# EAGLE design eCog107_Remote_Control (EAGLE 6.6.0)

## Sheet 1 of 2
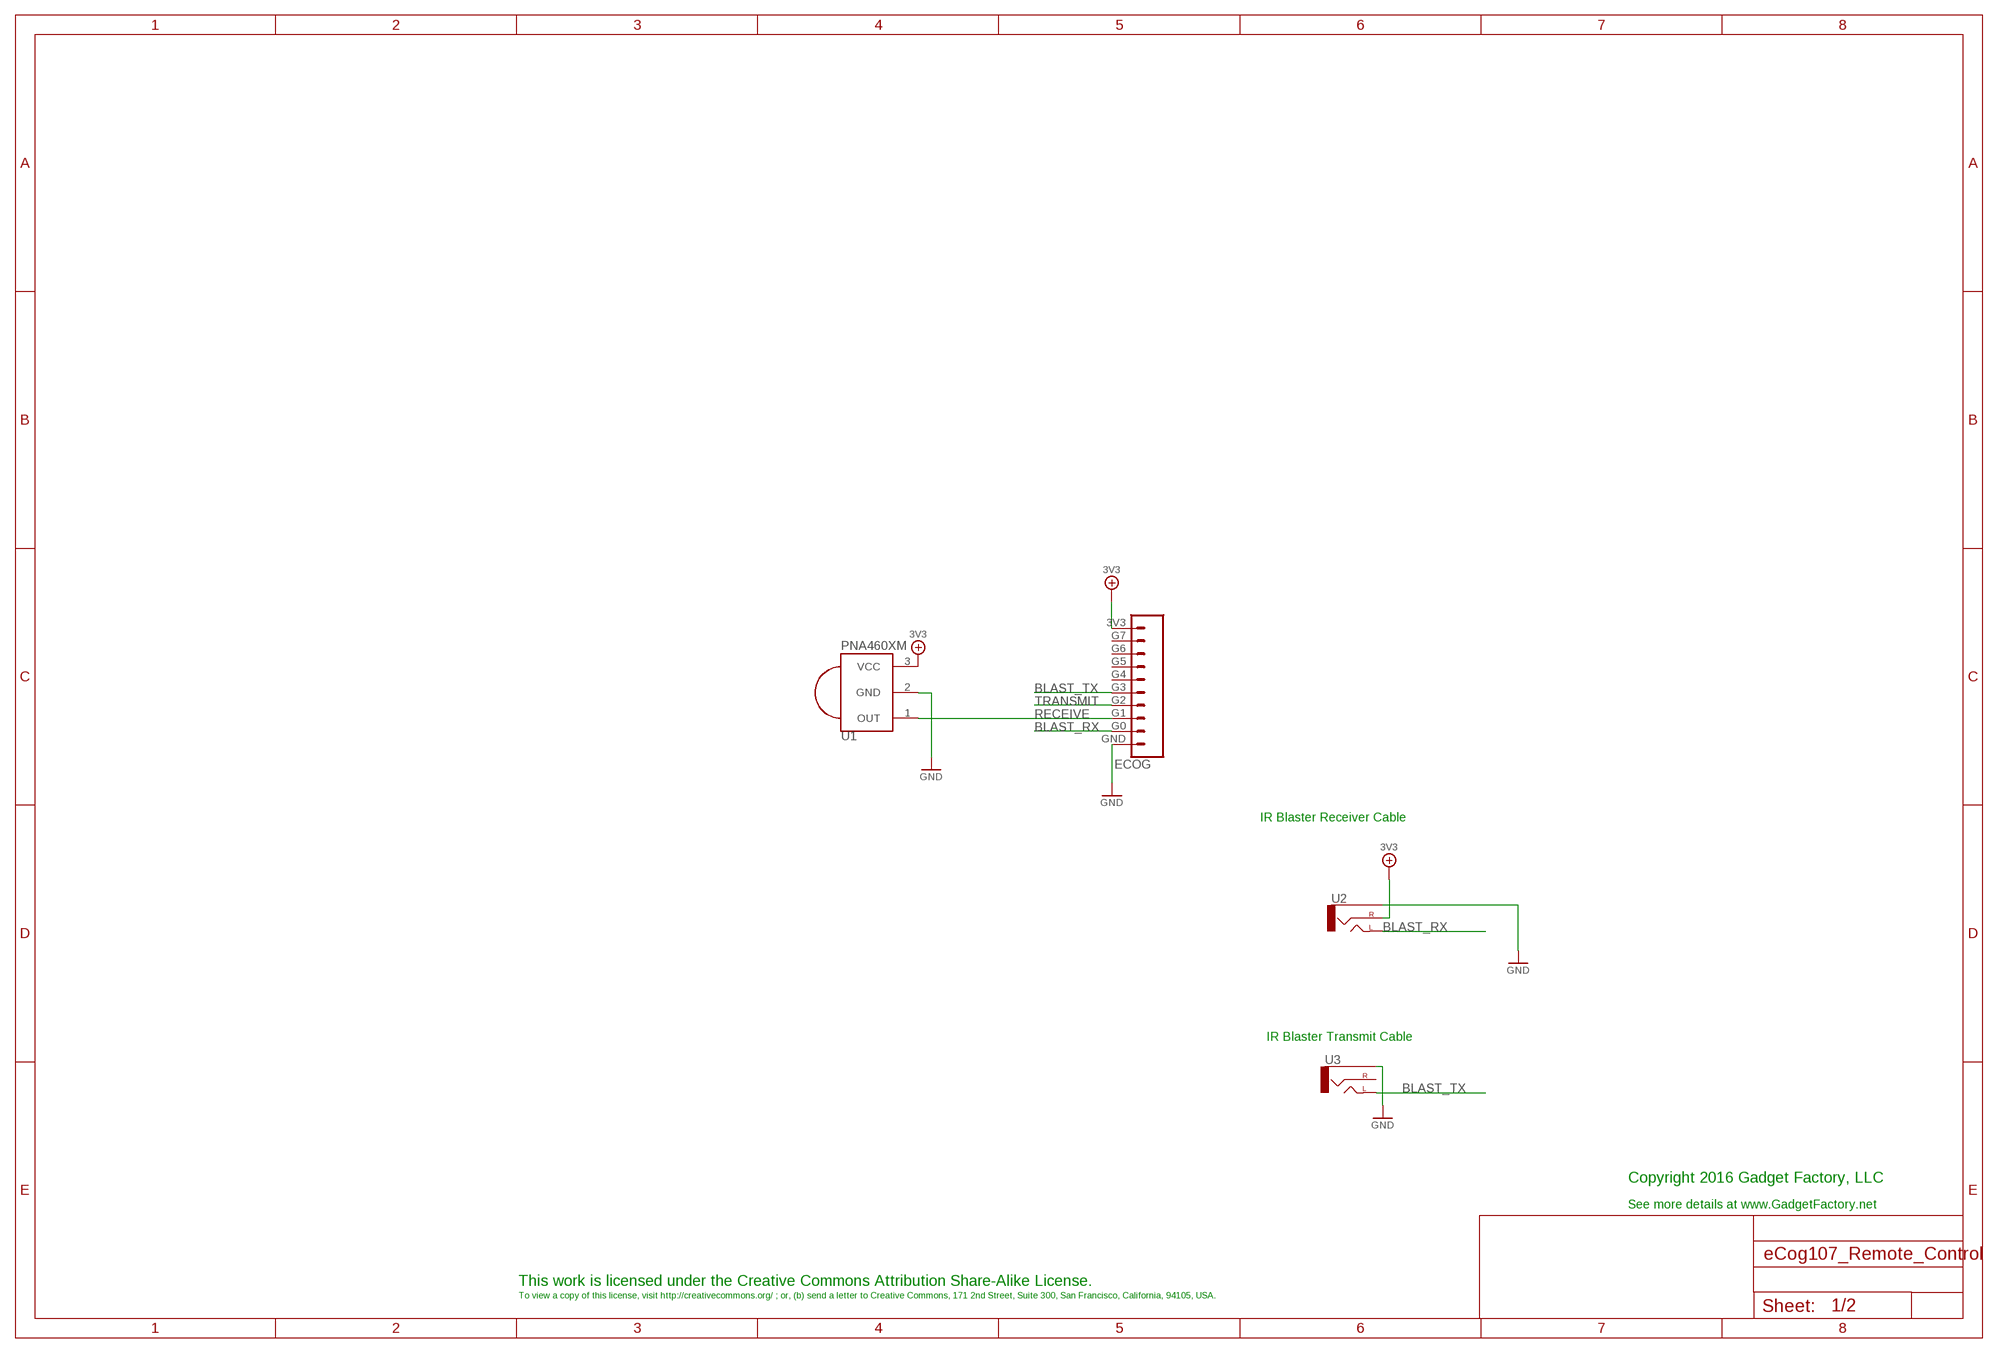
[diagram p0: schematic, sheet 1]

### Parts
ECOG  ECOG_GENERAL_ROWECOG_GENERAL_SMD  [ECOG_GENERAL_SMD]
U1  PNA460XM  [PNA460XM]
U2  AUDIO-JACKSMD2  [AUDIO-JACK-3.5MM-SMD]
U3  AUDIO-JACKSMD2  [AUDIO-JACK-3.5MM-SMD]

### Nets
3V3: ECOG.3V3 U1.3(VCC) U2.RING(RIGHT) ; also sheet 2
BLAST_RX: ECOG.G0 U2.TIP(LEFT)
BLAST_TX: ECOG.G3 U3.TIP(LEFT)
GND: ECOG.GND U1.2(GND) U2.SLEEVE U3.SLEEVE ; also sheet 2
RECEIVE: ECOG.G1 U1.1(OUT)
TRANSMIT: ECOG.G2 ; also sheet 2
Unconnected: ECOG.G4 ECOG.G5 ECOG.G6 ECOG.G7 U3.RING(RIGHT)

### Notes on the sheet
- IR Blaster Receiver Cable
- IR Blaster Transmit Cable
- Copyright 2016 Gadget Factory, LLC
- See more details at www.GadgetFactory.net
- This work is licensed under the Creative Commons Attribution Share-Alike License.
- To view a copy of this license, visit http://creativecommons.org/ ; or, (b) send a letter to Creative Commons, 171 2nd Street, Suite 300, San Francisco, California, 94105, USA.

## Sheet 2 of 2
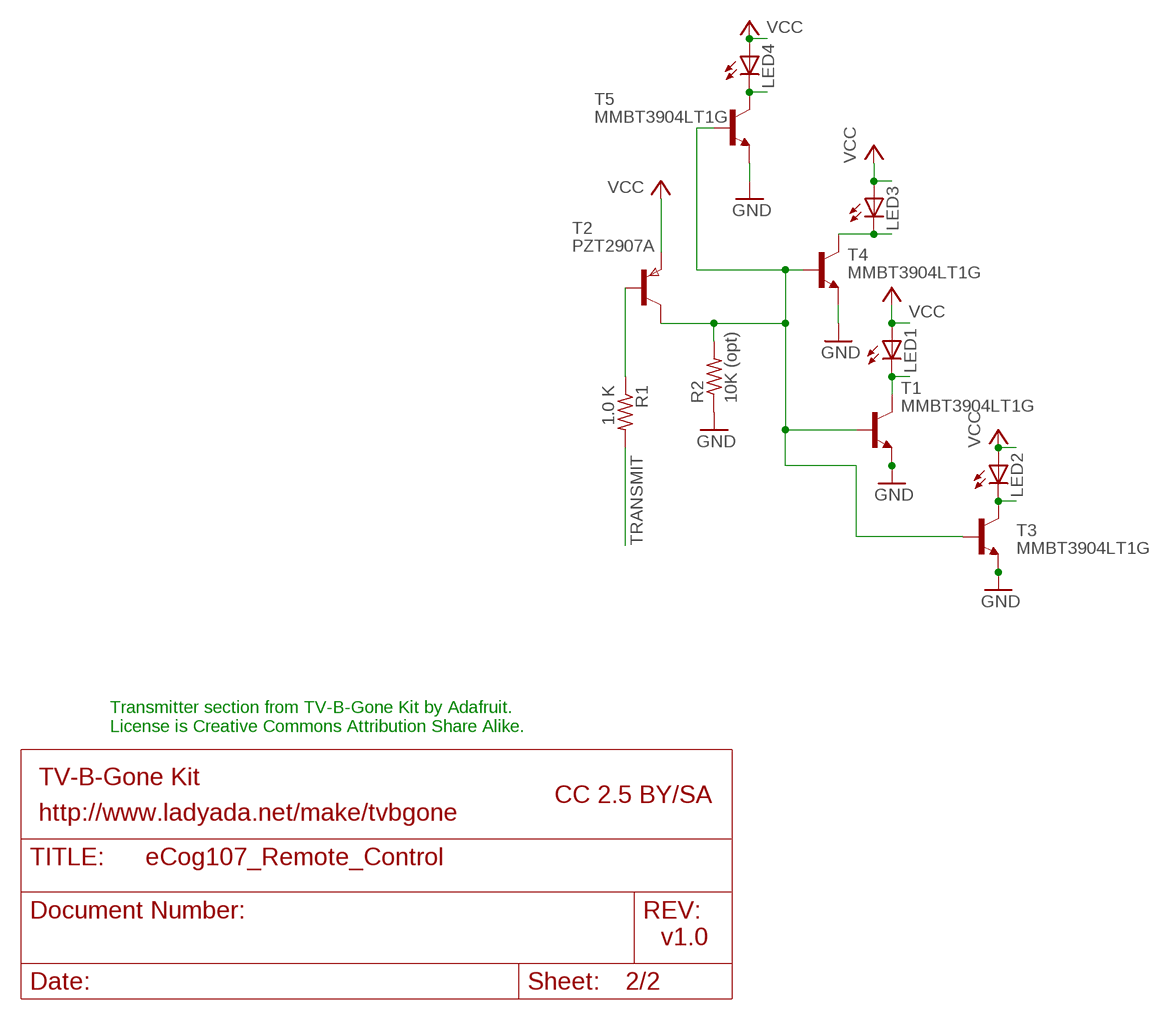
[diagram p1: schematic, sheet 2]

### Parts
LED1  LED5MM  [LED5MM]
LED2  LED5MM  [LED5MM]
LED3  LED5MM  [LED5MM]
LED4  LED5MM  [LED5MM]
R1  1.0 K  R-US_R0805  [R0805]
R2  10K (opt)  R-US_R0805  [R0805]
T1  MMBT3904LT1G  MMBT3904LT1-NPN-SOT23-BEC  [SOT23-BEC]
T2  PZT2907A  PNPSOT223  [SOT223]
T3  MMBT3904LT1G  MMBT3904LT1-NPN-SOT23-BEC  [SOT23-BEC]
T4  MMBT3904LT1G  MMBT3904LT1-NPN-SOT23-BEC  [SOT23-BEC]
T5  MMBT3904LT1G  MMBT3904LT1-NPN-SOT23-BEC  [SOT23-BEC]

### Nets
3V3: LED1.A LED2.A LED3.A LED4.A T2.3(E) ; supply symbol labelled VCC ; also sheet 1
GND: R2.1 T1.E T3.E T4.E T5.E ; also sheet 1
N$6: R1.1 T2.1(B)
N$7: LED1.K(C) T1.C
N$8: LED3.K(C) T4.C
N$9: LED2.K(C) T3.C
N$10: R2.2 T1.B T2.2(C) T2.4(C) T3.B T4.B T5.B
N$11: LED4.K(C) T5.C
TRANSMIT: R1.2 ; also sheet 1

### Notes on the sheet
- Transmitter section from TV-B-Gone Kit by Adafruit. 
  License is Creative Commons Attribution Share Alike.
- TV-B-Gone Kit
- CC 2.5 BY/SA
- http://www.ladyada.net/make/tvbgone
- v1.0

## Library data of the parts
ECOG = eCogs:ECOG_GENERAL_ROW; DIGIKEY: S1013EC-10-ND
LED1 LED4 = adafruit:LED: LED OSRAM: - CHIPLED LG R971, LG N971, LY N971, LG Q971, LY Q971, LO R971, LY R971 LH N974, LH R974 LS Q976, LO Q976, LY Q976 LO Q996 - Hyper CHIPLED LW Q18S LB Q993, LB Q99A, LB R99A - SideLED LS A670, LO A670, LY A670, LG A670, LP A670 LB A673, LV A673, LT A673, LW A673 LH A674 LY A675 LS A676, LA A676, LO A676, LY A676, LW A676 LS A679, LY A679, LG A679 - Hyper Micro SIDELED® LS Y876, LA Y876, LO Y876, LY Y876 LT Y87S - SmartLED LW L88C, LW L88S LB L89C, LB L89S, LG L890 LS L89K, LO L89K, LY L89K LS L896, LA L896, LO L896, LY L896 - TOPLED LS T670, LO T670, LY T670, LG T670, LP T670 LSG T670, LSP T670, LSY T670, LOP T670, LYG T670 LG T671, LOG T671, LSG T671 LB T673, LV T673, LT T673, LW T673 LH T674 LS T676, LA T676, LO T676, LY T676, LB T676, LH T676, LSB T676, LW T676 LB T67C, LV T67C, LT T67C, LS T67K, LO T67K, LY T67K, LW E67C LS E67B, LA E67B, LO E67B, LY E67B, LB E67C, LV E67C, LT E67C LW T67C LS T679, LY T679, LG T679 LS T770, LO T770, LY T770, LG T770, LP T770 LB T773, LV T773, LT T773, LW T773 LH T774 LS E675, LA E675, LY E675, LS T675 LS T776, LA T776, LO T776, LY T776, LB T776 LHGB T686 LT T68C, LB T68C - Hyper Mini TOPLED® LB M676 - Mini TOPLED Santana® LG M470 LS M47K, LO M47K, LY M47K Source: http://www.osram.convergy.de/; DIGIKEY: 1080-1082-ND
LED2 LED3 = adafruit:LED: LED OSRAM: - CHIPLED LG R971, LG N971, LY N971, LG Q971, LY Q971, LO R971, LY R971 LH N974, LH R974 LS Q976, LO Q976, LY Q976 LO Q996 - Hyper CHIPLED LW Q18S LB Q993, LB Q99A, LB R99A - SideLED LS A670, LO A670, LY A670, LG A670, LP A670 LB A673, LV A673, LT A673, LW A673 LH A674 LY A675 LS A676, LA A676, LO A676, LY A676, LW A676 LS A679, LY A679, LG A679 - Hyper Micro SIDELED® LS Y876, LA Y876, LO Y876, LY Y876 LT Y87S - SmartLED LW L88C, LW L88S LB L89C, LB L89S, LG L890 LS L89K, LO L89K, LY L89K LS L896, LA L896, LO L896, LY L896 - TOPLED LS T670, LO T670, LY T670, LG T670, LP T670 LSG T670, LSP T670, LSY T670, LOP T670, LYG T670 LG T671, LOG T671, LSG T671 LB T673, LV T673, LT T673, LW T673 LH T674 LS T676, LA T676, LO T676, LY T676, LB T676, LH T676, LSB T676, LW T676 LB T67C, LV T67C, LT T67C, LS T67K, LO T67K, LY T67K, LW E67C LS E67B, LA E67B, LO E67B, LY E67B, LB E67C, LV E67C, LT E67C LW T67C LS T679, LY T679, LG T679 LS T770, LO T770, LY T770, LG T770, LP T770 LB T773, LV T773, LT T773, LW T773 LH T774 LS E675, LA E675, LY E675, LS T675 LS T776, LA T776, LO T776, LY T776, LB T776 LHGB T686 LT T68C, LB T68C - Hyper Mini TOPLED® LB M676 - Mini TOPLED Santana® LG M470 LS M47K, LO M47K, LY M47K Source: http://www.osram.convergy.de/; DIGIKEY: 1080-1080-ND
R1 = rcl-ez:R-US_: RESISTOR, American symbol; DIGIKEY: 311-1.0KARCT-ND
R2 = rcl-ez:R-US_: RESISTOR, American symbol; DIGIKEY: RMCF0805JT10K0CT-ND
T1 T3-T5 = transistor:*-NPN-: NPN Transistror BF959 corrected 2008.03.06; DIGIKEY: MMBT3904LT1GOSCT-ND
T2 = zetex:PNPSOT223: PNP TRANSISTOR; DIGIKEY: PZT2907ACT-ND; MPN: DJT4030P-13; OC_FARNELL: 1710675; OC_NEWARK: 25R4489
U1 = adafruit:PNA460XM: IR 38KHz receiver PNA4602 and related receivers http://www.ladyada.net/library/pcb/eaglelibrary.html; DIGIKEY: 751-1227-ND
U2 U3 = SparkFun:AUDIO-JACK: 3.5mm Audio Jack Simple 3.5mm common PCB mount audio jack. SKU: PRT-08032; DIGIKEY: CP-3523SJTR-ND

## Board
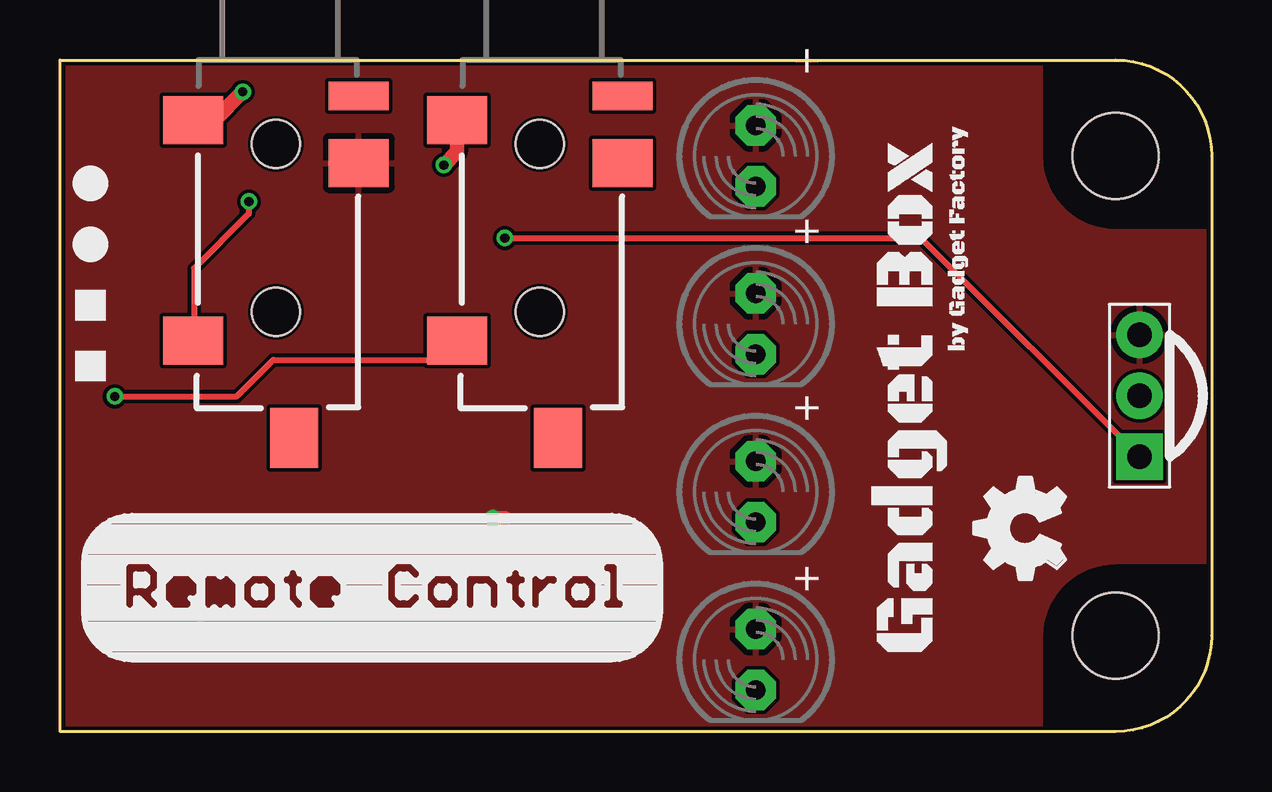
[diagram p2: board, top side]
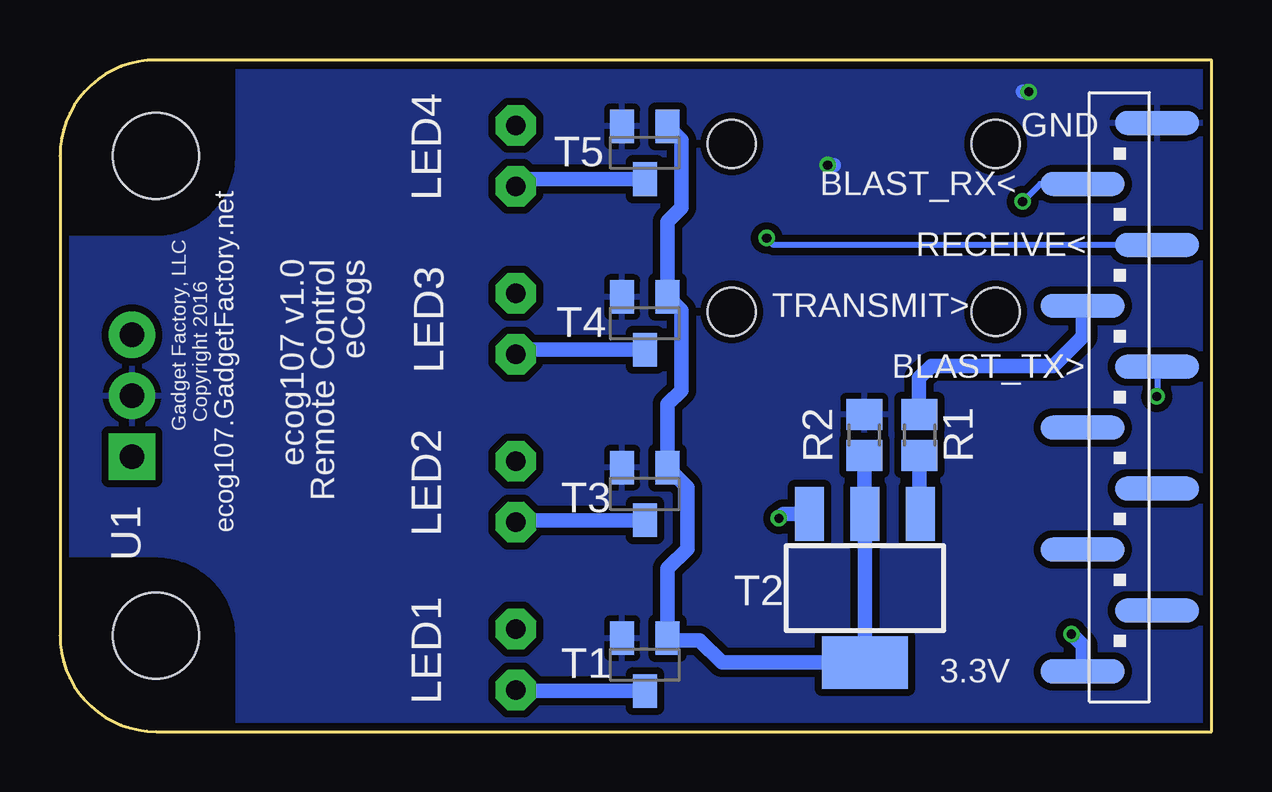
[diagram p3: board, bottom side, seen from below]

Size 48 x 28 mm. Coordinates in mm from the lower left corner, seen from the top.
Copper layers (1*16): Top 0.035mm / dielectric 1.5mm / Bottom 0.035mm
Design rules "hackvana *": minimum track width 6mil, minimum drill 0.3mm, track to track 6mil, track to pad 6mil, pad to pad 6mil, via to via 6mil, smd to smd 0mil, copper to edge 6mil, drill to drill 6mil, minimum pad ring 10mil, minimum via ring 6mil, stop-mask expansion 2mil, vias tented up to drill 100mil, thermal gap 10mil

### Footprints (pad centres in the part's own frame; a part is rotated, then mirrored left to right if it is on the bottom)
ECOG_GENERAL_SMD = smd 3.5 x 1 bottom: 3V3 5.369,2.51; G0 5.369,22.83; G1 2.271,20.29; G2 5.369,17.75; G3 2.271,15.21; G4 5.369,12.67; G5 2.271,10.13; G6 5.369,7.59; G7 2.271,5.05; GND 2.271,25.37 | hole 3.6: 44,4; 44,24
LED5MM = drill 0.813 pad 1.676 octagon: A -1.27,0; K 1.27,0
R0805 = smd 1.3 x 1.5: 1 -0.85,0; 2 0.85,0
SOT23-BEC = smd 1 x 1.4: B -0.95,-1.1; C 0,1.1; E 0.95,-1.1
SOT223 = smd 1.219 x 2.235: 1 -2.311,-3.099; 2 0,-3.099; 3 2.311,-3.099 | smd 3.6 x 2.2: 4 0,3.099
PNA460XM = drill 1.016 pad 1.93 square: 1 -2.54,0 | drill 1.016 pad 1.93: 2 0,0; 3 2.54,0
AUDIO-JACK-3.5MM-SMD = smd 2 x 2.5: RING 4.3,3.45; SLEEVE 2.5,-3.45; TIP 11.7,-3.45 | smd 1.2 x 2.5: RSH 1.5,3.45 | smd 2.5 x 2: TSH 15.75,0.75 | hole 2: 3.5,0; 10.5,0

### Placement (x,y rotation side)
ECOG  0,0 0 top
LED1  29,3 270 top
LED2  29,10 270 top
LED3  29,17 270 top
LED4  29,24 270 top
R1  12.18,12.37 90 bottom
R2  14.48,12.37 270 bottom
T1  23.62,2.79 180 bottom
T2  14.45,5.98 180 bottom
T3  23.62,9.91 180 bottom
T4  23.62,17.02 180 bottom
T5  23.62,24.13 180 bottom
U1  45,14 90 top
U2  9,28 270 top
U3  20,28 270 top
U$1  [LEGEND_PWM]  1.27,15.24 0 top
U$2  [LEGEND_PWM]  1.27,17.78 0 top
U$3  [LEGEND_DIO]  1.27,20.32 0 top
U$4  [LEGEND_DIO]  1.27,22.86 0 top
U$5  [GADGETBOX_SMALL]  35.46,14 90 top
U$6  [OSHW_FILLX150_NOTEXT]  41.91,6.35 90 top

### Tracks (layer width: path | path; a pad name or v marks a point on that pad's centre or on a via)
3V3  (via drill 0.38)
  Top 0.61: v5.84,4.06 5.84,4.32 | v18.03,8.89 18.54,8.89
  Bottom 0.61: ECOG.3V3 5.37,3.59 v5.84,4.06 | T2.3 17.85,9.07 v18.03,8.89
  pour Top: -1,29 49,29 49,-1 -1,-1
BLAST_RX  (via drill 0.38)
  Top 0.254: v7.87,22.1 7.87,21.59 5.59,19.3 5.59,16.34 U2.TIP
  Bottom 0.254: ECOG.G0 7.14,22.83 v7.87,22.1
BLAST_TX  (via drill 0.38)
  Top 0.254: v2.29,13.97 7.37,13.97 8.89,15.49 15.74,15.49 U3.TIP
  Bottom 0.254: ECOG.G3 2.27,13.98 v2.29,13.97
GND  (via drill 0.38)
  Top 0.61: U3.SLEEVE 16.55,24.17 v16,23.62 | U2.SLEEVE 6.45,25.5 v7.62,26.67
  Bottom 0.61: v16,23.62 15.75,23.62 | v7.62,26.67 7.87,26.67
  pour Bottom (isolate 0.305): -2,30 50,30 50,-2 -2,-2
N$6
  Bottom 0.61: R1.1 12.18,9.11 T2.1
N$7
  Bottom 0.61: T1.C 28.96,1.69 LED1.K
N$8
  Bottom 0.61: T4.C 28.81,15.92 LED3.K
N$9
  Bottom 0.61: T3.C 28.92,8.81 LED2.K
N$10
  Bottom 0.61: R2.2 14.48,9.1 T2.2 T2.4 20.4,2.88 21.34,3.81 22.59,3.81 T1.B 22.67,6.79 21.84,7.62 21.84,10.18 T3.B 22.67,13.65 22.1,14.22 22.1,17.54 T4.B 22.67,21.27 22.1,21.84 22.1,24.66 T5.B
N$11
  Bottom 0.61: T5.C 28.7,23.03 LED4.K
RECEIVE  (via drill 0.38)
  Top 0.254: v18.54,20.57 35.89,20.57 U1.1
  Bottom 0.254: ECOG.G1 18.26,20.29 v18.54,20.57
TRANSMIT
  Bottom 0.61: ECOG.G2 5.37,16.48 6.6,15.24 11.68,15.24 12.19,14.73 12.19,13.23 R1.2

### Text on the board
tPlace: + | + | + | +
bPlace: GND | ecog107.GadgetFactory.net | BLAST_RX< | Gadget Factory, LLC | RECEIVE< | eCogs | Remote Control | ecog107 v1.0 | Copyright 2016 | TRANSMIT> | BLAST_TX> | 3.3V